# EAGLE schematic CCU_board (EAGLE 9.1.2)
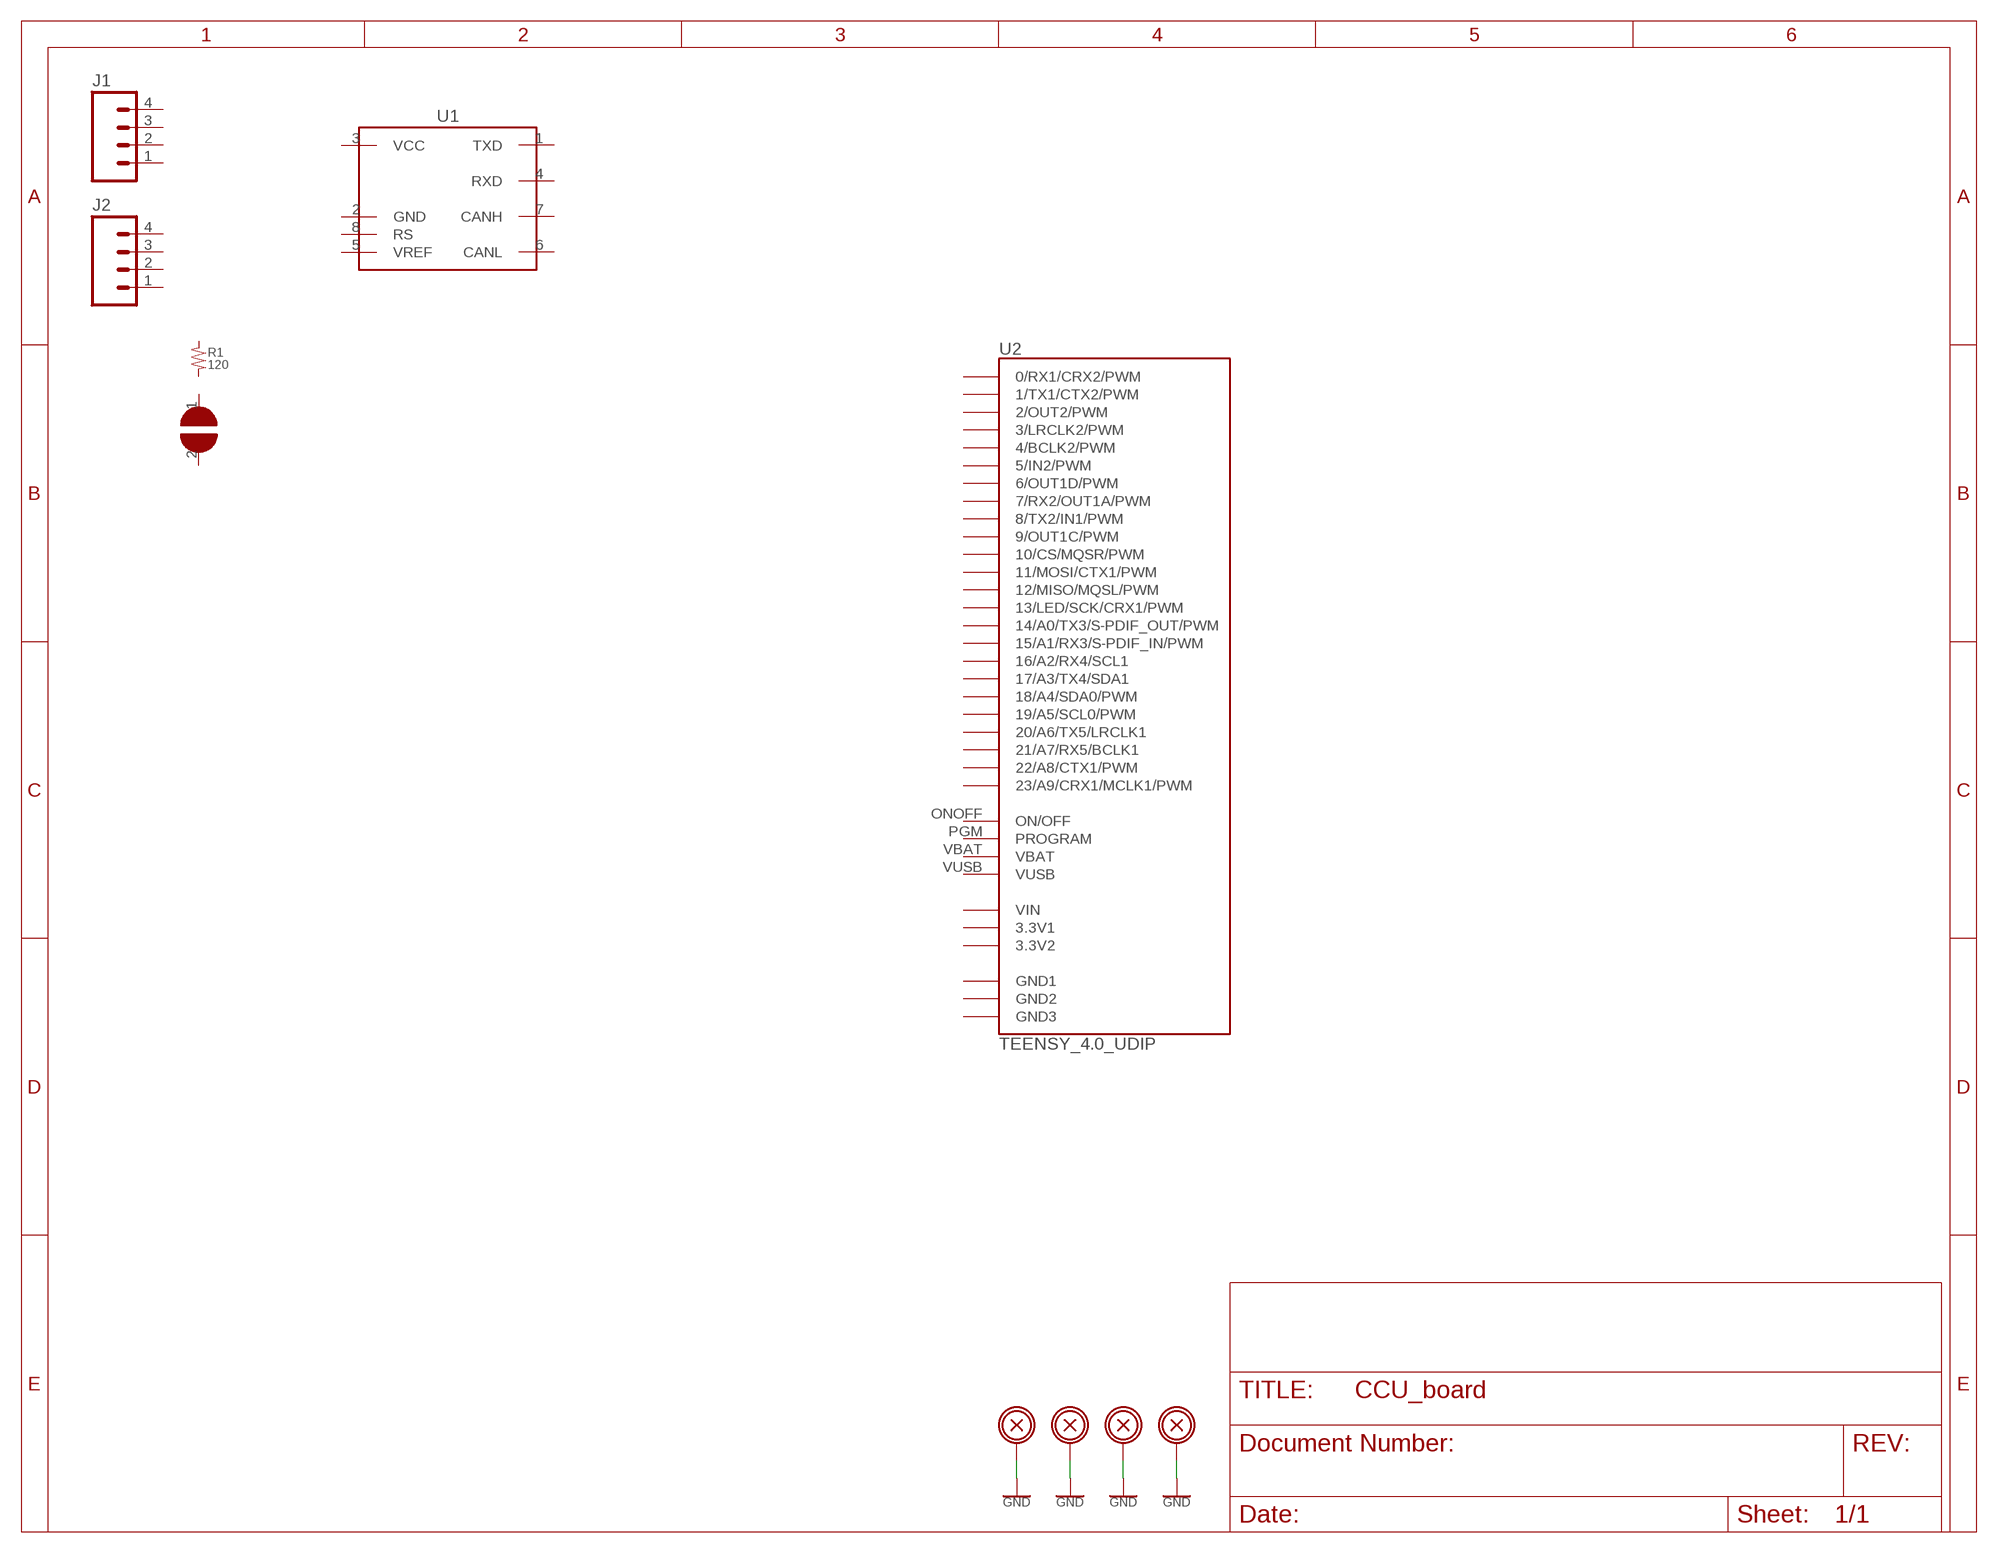
[diagram p0: schematic, sheet 1]

## Parts
H1  BOLTHOLE_M3  [M3_HOLE]
H2  BOLTHOLE_M3  [M3_HOLE]
H3  BOLTHOLE_M3  [M3_HOLE]
H4  BOLTHOLE_M3  [M3_HOLE]
J1  SM04B-SRSS-TB  [SM04B-SRSS-TB]
J2  SM04B-SRSS-TB  [SM04B-SRSS-TB]
R1  120  RES_SMD_0402  [0402]
SJ1  SOLDERABLE_JUMPER_1POS_NP  [SJ_2S-NO]
U1  SN65HVD23X  [SOIC_8]
U2  TEENSY_4.0_UDIP  [TEENSY_4.0_UDIP]

## Nets
GND: H1.P H2.P H3.P H4.P
Unconnected: J1.1 J1.2 J1.3 J1.4 J2.1 J2.2 J2.3 J2.4 R1.1 R1.2 SJ1.1 SJ1.2 U1.1(TXD) U1.2(GND) U1.3(VCC) U1.4(RXD) U1.5(VREF) U1.6(CANL) U1.7(CANH) U1.8(RS) U2.0(0/RX1/CRX2/PWM) U2.1(1/TX1/CTX2/PWM) U2.2(2/OUT2/PWM) U2.3(3/LRCLK2/PWM) U2.4(4/BCLK2/PWM) U2.5(5/IN2/PWM) U2.6(6/OUT1D/PWM) U2.7(7/RX2/OUT1A/PWM) U2.8(8/TX2/IN1/PWM) U2.9(9/OUT1C/PWM) U2.10(10/CS/MQSR/PWM) U2.11(11/MOSI/CTX1/PWM) U2.12(12/MISO/MQSL/PWM) U2.13(13/LED/SCK/CRX1/PWM) U2.14(14/A0/TX3/S-PDIF_OUT/PWM) U2.15(15/A1/RX3/S-PDIF_IN/PWM) U2.16(16/A2/RX4/SCL1) U2.17(17/A3/TX4/SDA1) U2.18(18/A4/SDA0/PWM) U2.19(19/A5/SCL0/PWM) U2.20(20/A6/TX5/LRCLK1) U2.21(21/A7/RX5/BCLK1) U2.22(22/A8/CTX1/PWM) U2.23(23/A9/CRX1/MCLK1/PWM) U2.ONOFF(ON/OFF) U2.PGM(PROGRAM) U2.VBAT U2.VUSB

## Power pins joined to a net without a drawn wire
3.3V1: U2.3.3V1
3.3V2: U2.3.3V2
GND1: U2.GND1
GND2: U2.GND2
GND3: U2.GND3
VIN: U2.VIN

## Library data of the parts
H1-H4 = FPGA_FOC_lib:BOLTHOLE
J1 J2 = FPGA_FOC_lib:?M04B-SRSS-TB: Disconnectable Crimp style connector, 1.0mm pitch 4 contacts
R1 = FPGA_FOC_lib:RES_SMD
SJ1 = FPGA_FOC_lib:SOLDERABLE_JUMPER_1POS: A solderable two pin jumper with different solder paste options to preshort the pads
U1 = FPGA_FOC_lib:SN65HVD23X: SN65HVD23x 3.3-V CAN Bus Transceivers datasheet <http://www.ti.com/lit/ds/symlink/sn65hvd230.pdf>
U2 = FPGA_FOC_lib:TEENSY_4.0_UDIP